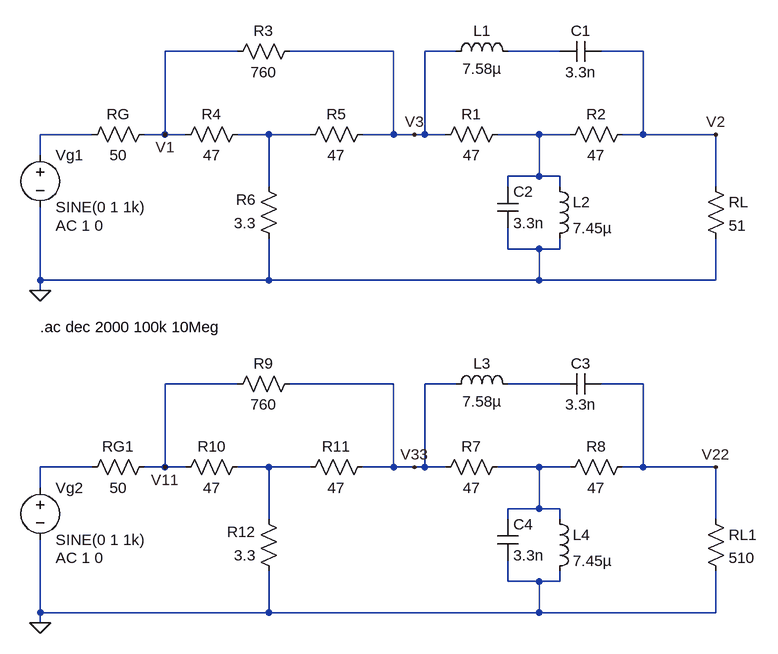
[diagram p0: schematic constant_impedance_with_laboratory_atenuator.asc]
constant_impedance_with_laboratory_atenuator.asc, the LTspice schematic file:
Version 4
SHEET 1 880 884
WIRE 32 -16 -80 -16
WIRE 272 -16 112 -16
WIRE 368 -16 320 -16
WIRE 528 -16 448 -16
WIRE 656 -16 592 -16
WIRE -192 112 -272 112
WIRE -80 112 -80 -16
WIRE -80 112 -112 112
WIRE -48 112 -80 112
WIRE 80 112 32 112
WIRE 144 112 80 112
WIRE 272 112 272 -16
WIRE 272 112 224 112
WIRE 304 112 272 112
WIRE 320 112 320 -16
WIRE 320 112 304 112
WIRE 352 112 320 112
WIRE 496 112 432 112
WIRE 544 112 496 112
WIRE 656 112 656 -16
WIRE 656 112 624 112
WIRE 768 112 656 112
WIRE -272 144 -272 112
WIRE 496 176 496 112
WIRE 496 176 448 176
WIRE 528 176 496 176
WIRE 80 192 80 112
WIRE 448 192 448 176
WIRE 528 192 528 176
WIRE 768 192 768 112
WIRE 448 288 448 256
WIRE 496 288 448 288
WIRE 528 288 528 272
WIRE 528 288 496 288
WIRE -272 336 -272 224
WIRE 80 336 80 272
WIRE 80 336 -272 336
WIRE 496 336 496 288
WIRE 496 336 80 336
WIRE 768 336 768 272
WIRE 768 336 496 336
WIRE -272 352 -272 336
WIRE 32 496 -80 496
WIRE 272 496 112 496
WIRE 368 496 320 496
WIRE 528 496 448 496
WIRE 656 496 592 496
WIRE -192 624 -272 624
WIRE -80 624 -80 496
WIRE -80 624 -112 624
WIRE -48 624 -80 624
WIRE 80 624 32 624
WIRE 144 624 80 624
WIRE 272 624 272 496
WIRE 272 624 224 624
WIRE 304 624 272 624
WIRE 320 624 320 496
WIRE 320 624 304 624
WIRE 352 624 320 624
WIRE 496 624 432 624
WIRE 544 624 496 624
WIRE 656 624 656 496
WIRE 656 624 624 624
WIRE 768 624 656 624
WIRE -272 656 -272 624
WIRE 496 688 496 624
WIRE 496 688 448 688
WIRE 528 688 496 688
WIRE 80 704 80 624
WIRE 448 704 448 688
WIRE 528 704 528 688
WIRE 768 704 768 624
WIRE 448 800 448 768
WIRE 496 800 448 800
WIRE 528 800 528 784
WIRE 528 800 496 800
WIRE -272 848 -272 736
WIRE 80 848 80 784
WIRE 80 848 -272 848
WIRE 496 848 496 800
WIRE 496 848 80 848
WIRE 768 848 768 784
WIRE 768 848 496 848
WIRE -272 864 -272 848
FLAG -272 352 0
FLAG 768 112 V2
FLAG -80 112 V1
FLAG 304 112 V3
FLAG -272 864 0
FLAG 768 624 V22
FLAG -80 624 V11
FLAG 304 624 V33
SYMBOL voltage -272 128 R0
WINDOW 123 24 124 Left 2
WINDOW 39 0 0 Left 0
SYMATTR Value2 AC 1 0
SYMATTR InstName Vg1
SYMATTR Value SINE(0 1 1k)
SYMBOL res -96 96 R90
WINDOW 0 0 56 VBottom 2
WINDOW 3 32 56 VTop 2
SYMATTR InstName RG
SYMATTR Value 50
SYMBOL res 448 96 R90
WINDOW 0 0 56 VBottom 2
WINDOW 3 32 56 VTop 2
SYMATTR InstName R1
SYMATTR Value 47
SYMBOL res 640 96 R90
WINDOW 0 0 56 VBottom 2
WINDOW 3 32 56 VTop 2
SYMATTR InstName R2
SYMATTR Value 47
SYMBOL res 752 176 R0
SYMATTR InstName RL
SYMATTR Value 51
SYMBOL ind 352 0 R270
WINDOW 0 32 56 VTop 2
WINDOW 3 5 56 VBottom 2
SYMATTR InstName L1
SYMATTR Value 7.58µ
SYMBOL cap 528 0 R270
WINDOW 0 32 32 VTop 2
WINDOW 3 0 32 VBottom 2
SYMATTR InstName C1
SYMATTR Value 3.3n
SYMBOL ind 512 176 R0
SYMATTR InstName L2
SYMATTR Value 7.45µ
SYMBOL cap 432 192 R0
SYMATTR InstName C2
SYMATTR Value 3.3n
SYMBOL res 128 -32 R90
WINDOW 0 0 56 VBottom 2
WINDOW 3 32 56 VTop 2
SYMATTR InstName R3
SYMATTR Value 760
SYMBOL res 48 96 R90
WINDOW 0 0 56 VBottom 2
WINDOW 3 32 56 VTop 2
SYMATTR InstName R4
SYMATTR Value 47
SYMBOL res 240 96 R90
WINDOW 0 0 56 VBottom 2
WINDOW 3 32 56 VTop 2
SYMATTR InstName R5
SYMATTR Value 47
SYMBOL res 96 288 R180
WINDOW 0 36 76 Left 2
WINDOW 3 36 40 Left 2
SYMATTR InstName R6
SYMATTR Value 3.3
SYMBOL voltage -272 640 R0
WINDOW 123 24 124 Left 2
WINDOW 39 0 0 Left 0
SYMATTR Value2 AC 1 0
SYMATTR InstName Vg2
SYMATTR Value SINE(0 1 1k)
SYMBOL res -96 608 R90
WINDOW 0 0 56 VBottom 2
WINDOW 3 32 56 VTop 2
SYMATTR InstName RG1
SYMATTR Value 50
SYMBOL res 448 608 R90
WINDOW 0 0 56 VBottom 2
WINDOW 3 32 56 VTop 2
SYMATTR InstName R7
SYMATTR Value 47
SYMBOL res 640 608 R90
WINDOW 0 0 56 VBottom 2
WINDOW 3 32 56 VTop 2
SYMATTR InstName R8
SYMATTR Value 47
SYMBOL res 752 688 R0
SYMATTR InstName RL1
SYMATTR Value 510
SYMBOL ind 352 512 R270
WINDOW 0 32 56 VTop 2
WINDOW 3 5 56 VBottom 2
SYMATTR InstName L3
SYMATTR Value 7.58µ
SYMBOL cap 528 512 R270
WINDOW 0 32 32 VTop 2
WINDOW 3 0 32 VBottom 2
SYMATTR InstName C3
SYMATTR Value 3.3n
SYMBOL ind 512 688 R0
SYMATTR InstName L4
SYMATTR Value 7.45µ
SYMBOL cap 432 704 R0
SYMATTR InstName C4
SYMATTR Value 3.3n
SYMBOL res 128 480 R90
WINDOW 0 0 56 VBottom 2
WINDOW 3 32 56 VTop 2
SYMATTR InstName R9
SYMATTR Value 760
SYMBOL res 48 608 R90
WINDOW 0 0 56 VBottom 2
WINDOW 3 32 56 VTop 2
SYMATTR InstName R10
SYMATTR Value 47
SYMBOL res 240 608 R90
WINDOW 0 0 56 VBottom 2
WINDOW 3 32 56 VTop 2
SYMATTR InstName R11
SYMATTR Value 47
SYMBOL res 96 800 R180
WINDOW 0 36 76 Left 2
WINDOW 3 36 40 Left 2
SYMATTR InstName R12
SYMATTR Value 3.3
TEXT -272 408 Left 2 !.ac dec 2000 100k 10Meg

The netlist it stands for:
* constant_impedance_with_laboratory_atenuator.asc
Vg1 N002 0 SINE(0 1 1k) AC 1 0
RG V1 N002 50
R1 N004 V3 47
R2 V2 N004 47
RL V2 0 51
L1 V3 N001 7.58µ
C1 N001 V2 3.3n
L2 N004 0 7.45µ
C2 N004 0 3.3n
R3 V3 V1 760
R4 N003 V1 47
R5 V3 N003 47
R6 0 N003 3.3
Vg2 N006 0 SINE(0 1 1k) AC 1 0
RG1 V11 N006 50
R7 N008 V33 47
R8 V22 N008 47
RL1 V22 0 510
L3 V33 N005 7.58µ
C3 N005 V22 3.3n
L4 N008 0 7.45µ
C4 N008 0 3.3n
R9 V33 V11 760
R10 N007 V11 47
R11 V33 N007 47
R12 0 N007 3.3
.ac dec 2000 100k 10Meg
.backanno
.end